# Altium schematic sheet RS485_CAN.SchDoc
size A; Organization: Altium Limited; Address1: 29 Dương Khuê; Address2: 2022 VIA Project; Address3: Draw by:; Address4: Tú Đặng
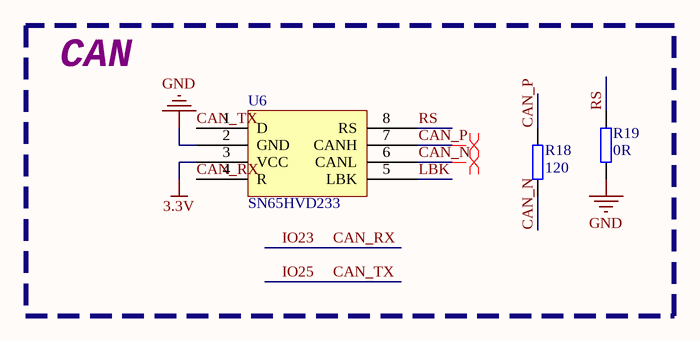
[diagram p0: RS485_CAN.SchDoc]

## Parts
R18  value 120  [SMT0603]  (hidden comment: Resistor)
R19  value 0R  [SMT0603]  (hidden comment: Resistor)
U6  SN65HVD233  [PCBComponent_1]

## Blocks framed on the sheet
CAN: R18 R19 U6

## Nets
3.3V: U6.3(VCC)
GND: R19.1 U6.2(GND)
CAN_N: R18.1 U6.6(CANL)
CAN_P: R18.2 U6.7(CANH)
CAN_RX: U6.4(R)  [also labelled IO23]
CAN_TX: U6.1(D)  [also labelled IO25]
LBK: U6.5(LBK)
RS: R19.2 U6.8(RS)

## Layout directives
differential pair: CAN_N, CAN_P

## Notes on the sheet
- Title
- Size:
- Date:
- A
- CN:
- Time:
- Revision:
- Sheet
- of
- Maker Việt
- 29 Dương Khuê
- 2022 VIA Project
- Draw by:
- Tú Đặng
- File:

## Library data of the parts
R18 R19 = RES-SM-0603-10K: RES SM 0603 10K; Supplier 1: Farnell; Supplier 2: Digi-Key; Supplier Part Number 1: 9330399; Supplier Part Number 2: 541-10.0KHCT-ND